# EAGLE schematic untitled (EAGLE 6.6.0)
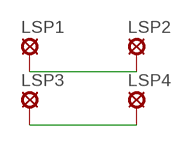
[diagram p0: schematic, sheet 1]

## Parts
LSP1  SE13  [SE13]
LSP2  SE13  [SE13]
LSP3  SE13  [SE13]
LSP4  SE13  [SE13]

## Nets
N$1: LSP1.MP LSP2.MP
N$2: LSP3.MP LSP4.MP

## Library data of the parts
LSP1-LSP4 = solpad:SE13: SOLDER PAD E1542, drill 1,3mm, distributor Buerklin, 07F815